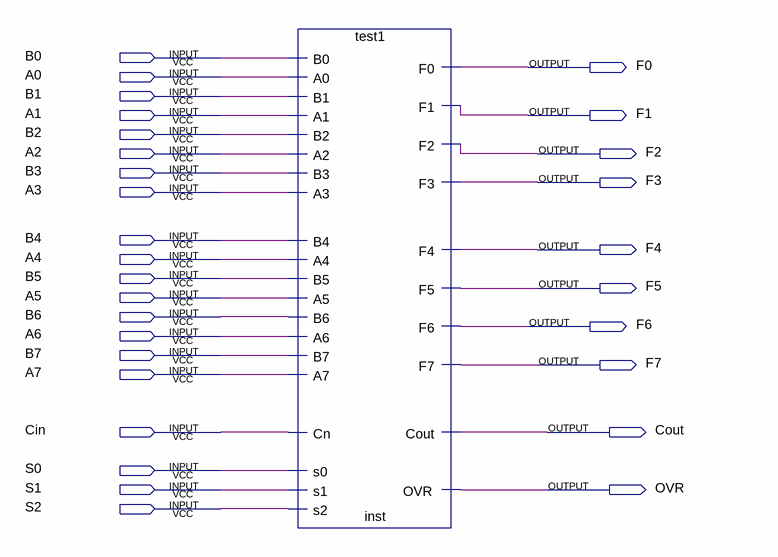
[diagram p0: schematic sheet]
// Quartus schematic EightBitALU.bdf as structural Verilog: 1 symbols, 30 pins
module EightBitALU (
  input  B0,
  input  A0,
  input  B1,
  input  A1,
  input  B2,
  input  A2,
  input  B3,
  input  A3,
  input  B4,
  input  A4,
  input  B5,
  input  A5,
  input  B6,
  input  A6,
  input  B7,
  input  A7,
  input  Cin,
  input  S0,
  input  S1,
  input  S2,
  output F0,
  output F1,
  output F2,
  output F3,
  output F4,
  output F5,
  output F6,
  output F7,
  output Cout,
  output OVR
);

  test1 inst (
    .s0(S0), .s1(S1), .s2(S2), .Cn(Cin), .B0(B0), .A0(A0), .A1(A1), .B2(B2), .A2(A2), .B3(B3), .A3(A3),
    .B4(B4), .A4(A4), .B5(B5), .A5(A5), .B6(B6), .A6(A6), .B7(B7), .A7(A7), .B1(B1), .F0(F0), .F1(F1),
    .F2(F2), .F3(F3), .F4(F4), .F5(F5), .F6(F6), .F7(F7), .Cout(Cout), .OVR(OVR));
endmodule
